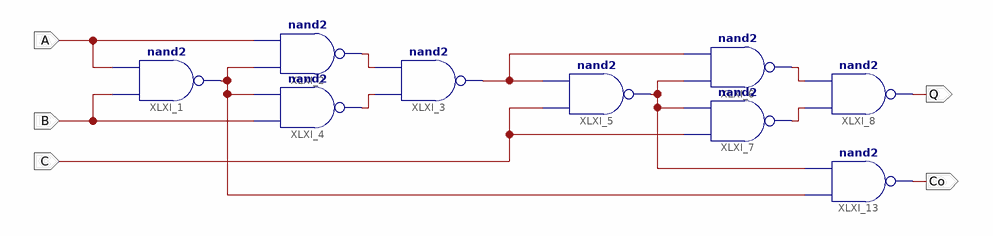
[diagram p0: schematic sheet 1]
// Xilinx ISE schematic Lab4_ex4.sch (spartan3e) as structural Verilog: 9 symbols, 5 ports
module Lab4_ex4 (
  input  C,
  input  B,
  input  A,
  output Q,
  output Co
);

  wire XLXN_1, XLXN_2, XLXN_19, XLXN_30, XLXN_31, XLXN_33, XLXN_38;

  nand XLXI_1 (XLXN_1, B, A);
  nand XLXI_2 (XLXN_2, XLXN_1, A);
  nand XLXI_3 (XLXN_38, XLXN_19, XLXN_2);
  nand XLXI_4 (XLXN_19, B, XLXN_1);
  nand XLXI_5 (XLXN_30, C, XLXN_38);
  nand XLXI_6 (XLXN_31, XLXN_30, XLXN_38);
  nand XLXI_7 (XLXN_33, C, XLXN_30);
  nand XLXI_8 (Q, XLXN_33, XLXN_31);
  nand XLXI_13 (Co, XLXN_1, XLXN_30);
endmodule
